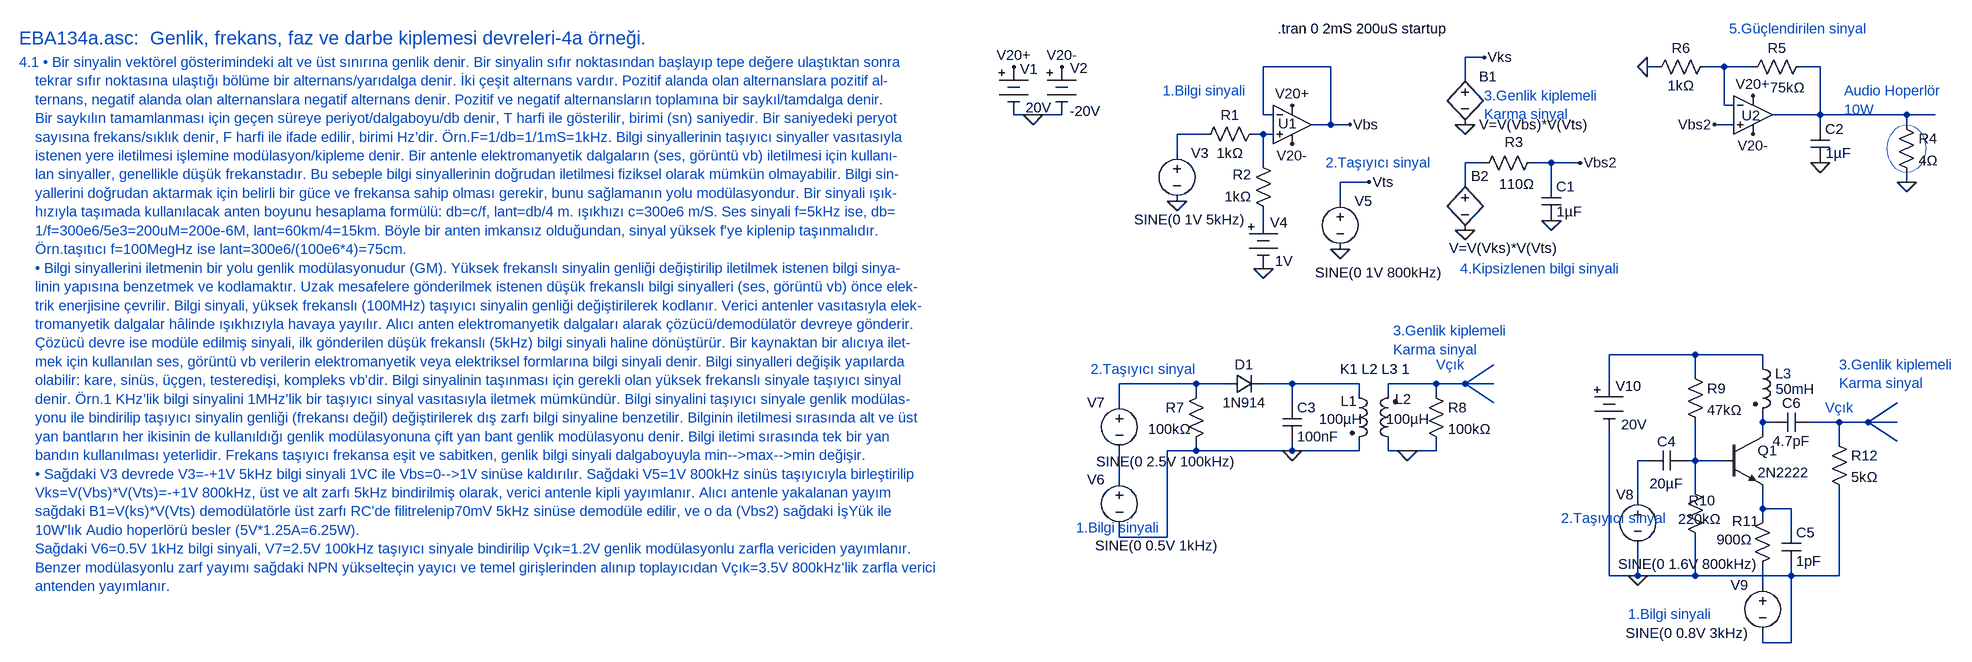
[diagram p0: schematic EBA134a.asc]
EBA134a.asc, the LTspice schematic file:
Version 4
SHEET 1 5332 4332
WIRE 2416 80 2384 80
WIRE 2160 96 2048 96
WIRE 2704 96 2688 96
WIRE 2816 96 2784 96
WIRE 2864 96 2816 96
WIRE 2976 96 2944 96
WIRE 2384 112 2384 80
WIRE 2816 160 2816 96
WIRE 2832 160 2816 160
WIRE 1664 176 1632 176
WIRE 1712 176 1664 176
WIRE 2048 176 2048 96
WIRE 2064 176 2048 176
WIRE 2976 176 2976 96
WIRE 2976 176 2896 176
WIRE 3120 176 2976 176
WIRE 3168 176 3120 176
WIRE 2160 192 2160 96
WIRE 2160 192 2128 192
WIRE 2192 192 2160 192
WIRE 2832 192 2800 192
WIRE 2976 192 2976 176
WIRE 3120 192 3120 176
WIRE 1952 208 1904 208
WIRE 2048 208 2032 208
WIRE 2064 208 2048 208
WIRE 1904 240 1904 208
WIRE 2048 256 2048 208
WIRE 2416 256 2384 256
WIRE 2528 256 2496 256
WIRE 2576 256 2528 256
WIRE 2224 288 2176 288
WIRE 2384 288 2384 256
WIRE 2528 288 2528 256
WIRE 3120 288 3120 272
WIRE 2176 320 2176 288
WIRE 2048 352 2048 336
WIRE 2768 576 2624 576
WIRE 2880 576 2768 576
WIRE 2880 592 2880 576
WIRE 2768 608 2768 576
WIRE 1936 624 1808 624
WIRE 1984 624 1936 624
WIRE 2096 624 2048 624
WIRE 2208 624 2096 624
WIRE 2336 624 2256 624
WIRE 2384 624 2432 592
WIRE 2384 624 2336 624
WIRE 2432 624 2384 624
WIRE 2624 624 2624 576
WIRE 1936 640 1936 624
WIRE 2208 640 2208 624
WIRE 2256 640 2256 624
WIRE 2336 640 2336 624
WIRE 1808 656 1808 624
WIRE 2096 656 2096 624
WIRE 2432 656 2384 624
WIRE 2880 688 2880 672
WIRE 2896 688 2880 688
WIRE 3008 688 2960 688
WIRE 3056 688 3104 656
WIRE 3056 688 3008 688
WIRE 3104 688 3056 688
WIRE 2880 704 2880 688
WIRE 3008 720 3008 688
WIRE 3104 720 3056 688
WIRE 1936 736 1936 720
WIRE 1936 736 1888 736
WIRE 2096 736 2096 720
WIRE 2096 736 1936 736
WIRE 2208 736 2208 720
WIRE 2208 736 2096 736
WIRE 2256 736 2256 720
WIRE 2288 736 2256 736
WIRE 2336 736 2336 720
WIRE 2336 736 2288 736
WIRE 2688 752 2672 752
WIRE 2768 752 2768 688
WIRE 2768 752 2752 752
WIRE 2816 752 2768 752
WIRE 1808 784 1808 736
WIRE 2768 800 2768 752
WIRE 2672 816 2672 752
WIRE 2880 832 2880 800
WIRE 2928 832 2880 832
WIRE 2880 848 2880 832
WIRE 2928 864 2928 832
WIRE 1808 880 1808 864
WIRE 1888 880 1888 736
WIRE 1888 880 1808 880
WIRE 2624 944 2624 704
WIRE 2672 944 2672 896
WIRE 2672 944 2624 944
WIRE 2768 944 2768 880
WIRE 2768 944 2672 944
WIRE 2928 944 2928 928
WIRE 2928 944 2768 944
WIRE 3008 944 3008 800
WIRE 3008 944 2928 944
WIRE 2880 960 2880 928
WIRE 2880 1056 2880 1040
WIRE 2928 1056 2928 944
WIRE 2928 1056 2880 1056
FLAG 1664 176 0
FLAG 1632 96 V20+
FLAG 1712 96 V20-
FLAG 2096 160 V20+
FLAG 2096 224 V20-
FLAG 1904 320 0
FLAG 2048 432 0
FLAG 2176 400 0
FLAG 2384 192 0
FLAG 2192 192 Vbs
FLAG 2224 288 Vts
FLAG 2416 80 Vks
FLAG 2384 368 0
FLAG 2528 352 0
FLAG 2576 256 Vbs2
FLAG 2976 256 0
FLAG 3120 288 0
FLAG 2864 144 V20+
FLAG 2864 208 V20-
FLAG 2688 96 0
FLAG 2800 192 Vbs2
FLAG 2096 736 0
FLAG 2288 736 0
FLAG 2672 944 0
SYMBOL Misc\\battery 1632 80 R0
WINDOW 0 11 20 Left 2
WINDOW 3 20 84 Left 2
SYMATTR InstName V1
SYMATTR Value 20V
SYMBOL Misc\\battery 1712 80 R0
WINDOW 0 14 18 Left 2
WINDOW 3 13 90 Left 2
SYMATTR InstName V2
SYMATTR Value -20V
SYMBOL Opamps\\UniversalOpamp2 2096 192 R0
WINDOW 0 -23 -1 Left 2
SYMATTR InstName U1
SYMBOL res 2048 192 R90
WINDOW 0 0 56 VBottom 2
WINDOW 3 32 56 VTop 2
SYMATTR InstName R1
SYMATTR Value 1kΩ
SYMBOL res 2064 352 R180
WINDOW 0 36 76 Left 2
WINDOW 3 36 40 Left 2
SYMATTR InstName R2
SYMATTR Value 1kΩ
SYMBOL voltage 1904 224 R0
WINDOW 3 -71 127 Left 2
WINDOW 123 0 0 Left 0
WINDOW 39 0 0 Left 0
SYMATTR Value SINE(0 1V 5kHz)
SYMATTR InstName V3
SYMBOL voltage 2176 304 R0
WINDOW 3 -42 135 Left 2
WINDOW 123 0 0 Left 0
WINDOW 39 0 0 Left 0
SYMATTR Value SINE(0 1V 800kHz)
SYMATTR InstName V5
SYMBOL bv 2384 96 R0
SYMATTR InstName B1
SYMATTR Value V=V(Vbs)*V(Vts)
SYMBOL bv 2384 272 R0
WINDOW 0 10 6 Left 2
WINDOW 3 -26 126 Left 2
SYMATTR InstName B2
SYMATTR Value V=V(Vks)*V(Vts)
SYMBOL res 2512 240 R90
WINDOW 0 -3 46 VBottom 2
WINDOW 3 36 41 VTop 2
SYMATTR InstName R3
SYMATTR Value 110Ω
SYMBOL cap 2512 288 R0
WINDOW 3 25 49 Left 2
SYMATTR Value 1µF
SYMATTR InstName C1
SYMBOL cap 2960 192 R0
WINDOW 3 25 48 Left 2
SYMATTR Value 1µF
SYMATTR InstName C2
SYMBOL res 3104 176 R0
SYMATTR InstName R4
SYMATTR Value 4Ω
SYMBOL res 2960 80 R90
WINDOW 0 0 56 VBottom 2
WINDOW 3 35 38 VTop 2
SYMATTR InstName R5
SYMATTR Value 75kΩ
SYMBOL res 2800 80 R90
WINDOW 0 0 56 VBottom 2
WINDOW 3 32 56 VTop 2
SYMATTR InstName R6
SYMATTR Value 1kΩ
SYMBOL OpAmps\\UniversalOpAmp 2864 176 R0
WINDOW 0 -19 1 Left 2
SYMATTR InstName U2
SYMBOL diode 1984 608 M90
WINDOW 0 0 32 VBottom 2
WINDOW 3 32 32 VTop 2
SYMATTR InstName D1
SYMATTR Value 1N914
SYMBOL res 1952 624 M0
WINDOW 3 25 76 Left 2
SYMATTR Value 100kΩ
SYMATTR InstName R7
SYMBOL cap 2080 720 M180
WINDOW 0 24 56 Left 2
WINDOW 3 24 8 Left 2
SYMATTR InstName C3
SYMATTR Value 100nF
SYMBOL ind2 2192 624 R0
WINDOW 0 -15 29 Left 2
WINDOW 3 -51 59 Left 2
SYMATTR InstName L1
SYMATTR Value 100µH
SYMATTR Type ind
SYMBOL ind2 2272 736 R180
WINDOW 0 -23 86 Left 2
WINDOW 3 -52 53 Left 2
SYMATTR InstName L2
SYMATTR Value 100µH
SYMATTR Type ind
SYMBOL res 2320 624 R0
SYMATTR InstName R8
SYMATTR Value 100kΩ
SYMBOL voltage 1808 768 M0
WINDOW 3 -163 126 Left 2
WINDOW 123 0 0 Left 0
WINDOW 39 0 0 Left 0
SYMATTR Value SINE(0 0.5V 1kHz)
SYMATTR InstName V6
SYMBOL voltage 1808 640 M0
WINDOW 3 -192 114 Left 2
WINDOW 123 0 0 Left 0
WINDOW 39 0 0 Left 0
SYMATTR Value SINE(0 2.5V 100kHz)
SYMATTR InstName V7
SYMBOL npn 2816 704 R0
SYMATTR InstName Q1
SYMATTR Value 2N2222
SYMBOL res 2752 592 R0
SYMATTR InstName R9
SYMATTR Value 47kΩ
SYMBOL res 2752 784 R0
WINDOW 0 5 35 Left 2
WINDOW 3 -13 66 Left 2
SYMATTR InstName R10
SYMATTR Value 220kΩ
SYMBOL cap 2752 736 R90
WINDOW 0 0 32 VBottom 2
WINDOW 3 39 32 VTop 2
SYMATTR InstName C4
SYMATTR Value 20µF
SYMBOL res 2896 832 M0
WINDOW 0 22 21 Left 2
WINDOW 3 33 52 Left 2
SYMATTR InstName R11
SYMATTR Value 900Ω
SYMBOL ind2 2864 576 R0
WINDOW 0 37 31 Left 2
WINDOW 3 38 57 Left 2
SYMATTR InstName L3
SYMATTR Value 50mH
SYMATTR Type ind
SYMBOL cap 2912 864 R0
SYMATTR InstName C5
SYMATTR Value 1pF
SYMBOL cap 2960 672 R90
WINDOW 0 0 32 VBottom 2
WINDOW 3 32 32 VTop 2
SYMATTR InstName C6
SYMATTR Value 4.7pF
SYMBOL res 2992 704 R0
SYMATTR InstName R12
SYMATTR Value 5kΩ
SYMBOL voltage 2672 800 M0
WINDOW 0 7 9 Left 2
WINDOW 3 -198 125 Left 2
WINDOW 123 0 0 Left 0
WINDOW 39 0 0 Left 0
SYMATTR InstName V8
SYMATTR Value SINE(0 1.6V 800kHz)
SYMBOL voltage 2880 944 M0
WINDOW 3 25 96 Left 2
WINDOW 123 0 0 Left 0
WINDOW 39 0 0 Left 0
SYMATTR Value SINE(0 0.8V 3kHz)
SYMATTR InstName V9
SYMBOL Misc\\battery 2624 608 R0
WINDOW 0 11 20 Left 2
WINDOW 3 20 84 Left 2
SYMATTR InstName V10
SYMATTR Value 20V
SYMBOL Misc\\battery 2048 336 R0
WINDOW 0 11 20 Left 2
WINDOW 3 20 84 Left 2
SYMATTR InstName V4
SYMATTR Value 1V
TEXT -224 48 Left 3 ;EBA134a.asc:  Genlik, frekans, faz ve darbe kiplemesi devreleri-4a örneği.
TEXT -224 88 Left 2 ;4.1 • Bir sinyalin vektörel gösterimindeki alt ve üst sınırına genlik denir. Bir sinyalin sıfır noktasından başlayıp tepe değere ulaştıktan sonra\n    tekrar sıfır noktasına ulaştığı bölüme bir alternans/yarıdalga denir. İki çeşit alternans vardır. Pozitif alanda olan alternanslara pozitif al-\n    ternans, negatif alanda olan alternanslara negatif alternans denir. Pozitif ve negatif alternansların toplamına bir saykıl/tamdalga denir.\n    Bir saykılın tamamlanması için geçen süreye periyot/dalgaboyu/db denir, T harfi ile gösterilir, birimi (sn) saniyedir. Bir saniyedeki peryot \n    sayısına frekans/sıklık denir, F harfi ile ifade edilir, birimi Hz’dir. Örn.F=1/db=1/1mS=1kHz. Bilgi sinyallerinin taşıyıcı sinyaller vasıtasıyla\n    istenen yere iletilmesi işlemine modülasyon/kipleme denir. Bir antenle elektromanyetik dalgaların (ses, görüntü vb) iletilmesi için kullanı-\n    lan sinyaller, genellikle düşük frekanstadır. Bu sebeple bilgi sinyallerinin doğrudan iletilmesi fiziksel olarak mümkün olmayabilir. Bilgi sin-\n    yallerini doğrudan aktarmak için belirli bir güce ve frekansa sahip olması gerekir, bunu sağlamanın yolu modülasyondur. Bir sinyali ışık-\n    hızıyla taşımada kullanılacak anten boyunu hesaplama formülü: db=c/f, lant=db/4 m. ışıkhızı c=300e6 m/S. Ses sinyali f=5kHz ise, db=\n    1/f=300e6/5e3=200uM=200e-6M, lant=60km/4=15km. Böyle bir anten imkansız olduğundan, sinyal yüksek f'ye kiplenip taşınmalıdır. \n    Örn.taşıtıcı f=100MegHz ise lant=300e6/(100e6*4)=75cm.\n    • Bilgi sinyallerini iletmenin bir yolu genlik modülasyonudur (GM). Yüksek frekanslı sinyalin genliği değiştirilip iletilmek istenen bilgi sinya-\n    linin yapısına benzetmek ve kodlamaktır. Uzak mesafelere gönderilmek istenen düşük frekanslı bilgi sinyalleri (ses, görüntü vb) önce elek-\n    trik enerjisine çevrilir. Bilgi sinyali, yüksek frekanslı (100MHz) taşıyıcı sinyalin genliği değiştirilerek kodlanır. Verici antenler vasıtasıyla elek-\n    tromanyetik dalgalar hâlinde ışıkhızıyla havaya yayılır. Alıcı anten elektromanyetik dalgaları alarak çözücü/demodülatör devreye gönderir. \n    Çözücü devre ise modüle edilmiş sinyali, ilk gönderilen düşük frekanslı (5kHz) bilgi sinyali haline dönüştürür. Bir kaynaktan bir alıcıya ilet-\n    mek için kullanılan ses, görüntü vb verilerin elektromanyetik veya elektriksel formlarına bilgi sinyali denir. Bilgi sinyalleri değişik yapılarda\n    olabilir: kare, sinüs, üçgen, testeredişi, kompleks vb'dir. Bilgi sinyalinin taşınması için gerekli olan yüksek frekanslı sinyale taşıyıcı sinyal \n    denir. Örn.1 KHz’lik bilgi sinyalini 1MHz'lik bir taşıyıcı sinyal vasıtasıyla iletmek mümkündür. Bilgi sinyalini taşıyıcı sinyale genlik modülas-\n    yonu ile bindirilip taşıyıcı sinyalin genliği (frekansı değil) değiştirilerek dış zarfı bilgi sinyaline benzetilir. Bilginin iletilmesi sırasında alt ve üst \n    yan bantların her ikisinin de kullanıldığı genlik modülasyonuna çift yan bant genlik modülasyonu denir. Bilgi iletimi sırasında tek bir yan \n    bandın kullanılması yeterlidir. Frekans taşıyıcı frekansa eşit ve sabitken, genlik bilgi sinyali dalgaboyuyla min-->max-->min değişir.\n    • Sağdaki V3 devrede V3=-+1V 5kHz bilgi sinyali 1VC ile Vbs=0-->1V sinüse kaldırılır. Sağdaki V5=1V 800kHz sinüs taşıyıcıyla birleştirilip\n    Vks=V(Vbs)*V(Vts)=-+1V 800kHz, üst ve alt zarfı 5kHz bindirilmiş olarak, verici antenle kipli yayımlanır. Alıcı antenle yakalanan yayım \n    sağdaki B1=V(ks)*V(Vts) demodülatörle üst zarfı RC'de filitrelenip70mV 5kHz sinüse demodüle edilir, ve o da (Vbs2) sağdaki İşYük ile\n    10W'lık Audio hoperlörü besler (5V*1.25A=6.25W).\n    Sağdaki V6=0.5V 1kHz bilgi sinyali, V7=2.5V 100kHz taşıyıcı sinyale bindirilip Vçık=1.2V genlik modülasyonlu zarfla vericiden yayımlanır.\n    Benzer modülasyonlu zarf yayımı sağdaki NPN yükselteçin yayıcı ve temel girişlerinden alınıp toplayıcıdan Vçık=3.5V 800kHz'lik zarfla verici\n    antenden yayımlanır.
TEXT 2072 32 Left 2 !.tran 0 2mS 200uS startup
TEXT 3016 136 Left 2 ;Audio Hoperlör\n10W
TEXT 2176 600 Left 2 !K1 L2 L3 1
TEXT 2336 592 Left 2 ;Vçık
TEXT 2984 664 Left 2 ;Vçık
TEXT 1880 136 Left 2 ;1.Bilgi sinyali
TEXT 2152 256 Left 2 ;2.Taşıyıcı sinyal
TEXT 2416 144 Left 2 ;3.Genlik kiplemeli\nKarma sinyal
TEXT 2376 432 Left 2 ;4.Kipsizlenen bilgi sinyali
TEXT 2824 32 Left 2 ;5.Güçlendirilen sinyal
TEXT 1736 864 Left 2 ;1.Bilgi sinyali
TEXT 1760 600 Left 2 ;2.Taşıyıcı sinyal
TEXT 2264 536 Left 2 ;3.Genlik kiplemeli\nKarma sinyal
TEXT 2656 1008 Left 2 ;1.Bilgi sinyali
TEXT 2544 848 Left 2 ;2.Taşıyıcı sinyal
TEXT 3008 592 Left 2 ;3.Genlik kiplemeli\nKarma sinyal
CIRCLE Normal 3152 272 3088 192 2

The netlist it stands for:
* EBA134a.asc
V1 V20+ 0 20V
V2 V20- 0 -20V
XU1 N004 Vbs V20+ V20- Vbs level.2 Avol=1Meg GBW=10Meg Slew=10Meg ilimit=25m rail=0 Vos=0 phimargin=45 en=0 enk=0 in=0 ink=0 Rin=500Meg  ; pins IN+ IN- V+ V- OUT
R1 N004 N003 1kΩ
R2 N006 N004 1kΩ
V3 N003 0 SINE(0 1V 5kHz)
V5 Vts 0 SINE(0 1V 800kHz)
B1 Vks 0 V=V(Vbs)*V(Vts)
B2 N005 0 V=V(Vks)*V(Vts)
R3 Vbs2 N005 110Ω
C1 Vbs2 0 1µF
C2 N002 0 1µF
R4 N002 0 4Ω
R5 N002 N001 75kΩ
R6 N001 0 1kΩ
XU2 Vbs2 N001 V20+ V20- N002 level1 Avol=1Meg GBW=10Meg Vos=0 En=0 Enk=0 In=0 Ink=0 Rin=500Meg  ; pins In+ In- V+ V- OUT
D1 N008 N009 1N914
R7 N008 0 100kΩ
C3 0 N009 100nF
L1 N009 0 100µH
L2 0 N010 100µH
R8 N010 0 100kΩ
V6 N015 0 SINE(0 0.5V 1kHz)
V7 N008 N015 SINE(0 2.5V 100kHz)
Q1 N011 N014 N016 0 2N2222
R9 N007 N014 47kΩ
R10 N014 0 220kΩ
C4 N014 N013 20µF
R11 N016 N017 900Ω
L3 N007 N011 50mH
C5 N016 0 1pF
C6 N012 N011 4.7pF
R12 N012 0 5kΩ
V8 N013 0 SINE(0 1.6V 800kHz)
V9 N017 0 SINE(0 0.8V 3kHz)
V10 N007 0 20V
V4 N006 0 1V
.model D D
.lib standard.dio
.model NPN NPN
.model PNP PNP
.lib standard.bjt
* EBA134a.asc:  Genlik, frekans, faz ve darbe kiplemesi devreleri-4a örneği.
* 4.1 • Bir sinyalin vektörel gösterimindeki alt ve üst sınırına genlik denir. Bir sinyalin sıfır noktasından başlayıp tepe değere ulaştıktan sonra
*     tekrar sıfır noktasına ulaştığı bölüme bir alternans/yarıdalga denir. İki çeşit alternans vardır. Pozitif alanda olan alternanslara pozitif al-
*     ternans, negatif alanda olan alternanslara negatif alternans denir. Pozitif ve negatif alternansların toplamına bir saykıl/tamdalga denir.
*     Bir saykılın tamamlanması için geçen süreye periyot/dalgaboyu/db denir, T harfi ile gösterilir, birimi (sn) saniyedir. Bir saniyedeki peryot
*     sayısına frekans/sıklık denir, F harfi ile ifade edilir, birimi Hz’dir. Örn.F=1/db=1/1mS=1kHz. Bilgi sinyallerinin taşıyıcı sinyaller vasıtasıyla
*     istenen yere iletilmesi işlemine modülasyon/kipleme denir. Bir antenle elektromanyetik dalgaların (ses, görüntü vb) iletilmesi için kullanı-
*     lan sinyaller, genellikle düşük frekanstadır. Bu sebeple bilgi sinyallerinin doğrudan iletilmesi fiziksel olarak mümkün olmayabilir. Bilgi sin-
*     yallerini doğrudan aktarmak için belirli bir güce ve frekansa sahip olması gerekir, bunu sağlamanın yolu modülasyondur. Bir sinyali ışık-
*     hızıyla taşımada kullanılacak anten boyunu hesaplama formülü: db=c/f, lant=db/4 m. ışıkhızı c=300e6 m/S. Ses sinyali f=5kHz ise, db=
*     1/f=300e6/5e3=200uM=200e-6M, lant=60km/4=15km. Böyle bir anten imkansız olduğundan, sinyal yüksek f'ye kiplenip taşınmalıdır.
*     Örn.taşıtıcı f=100MegHz ise lant=300e6/(100e6*4)=75cm.
*     • Bilgi sinyallerini iletmenin bir yolu genlik modülasyonudur (GM). Yüksek frekanslı sinyalin genliği değiştirilip iletilmek istenen bilgi sinya-
*     linin yapısına benzetmek ve kodlamaktır. Uzak mesafelere gönderilmek istenen düşük frekanslı bilgi sinyalleri (ses, görüntü vb) önce elek-
*     trik enerjisine çevrilir. Bilgi sinyali, yüksek frekanslı (100MHz) taşıyıcı sinyalin genliği değiştirilerek kodlanır. Verici antenler vasıtasıyla elek-
*     tromanyetik dalgalar hâlinde ışıkhızıyla havaya yayılır. Alıcı anten elektromanyetik dalgaları alarak çözücü/demodülatör devreye gönderir.
*     Çözücü devre ise modüle edilmiş sinyali, ilk gönderilen düşük frekanslı (5kHz) bilgi sinyali haline dönüştürür. Bir kaynaktan bir alıcıya ilet-
*     mek için kullanılan ses, görüntü vb verilerin elektromanyetik veya elektriksel formlarına bilgi sinyali denir. Bilgi sinyalleri değişik yapılarda
*     olabilir: kare, sinüs, üçgen, testeredişi, kompleks vb'dir. Bilgi sinyalinin taşınması için gerekli olan yüksek frekanslı sinyale taşıyıcı sinyal
*     denir. Örn.1 KHz’lik bilgi sinyalini 1MHz'lik bir taşıyıcı sinyal vasıtasıyla iletmek mümkündür. Bilgi sinyalini taşıyıcı sinyale genlik modülas-
*     yonu ile bindirilip taşıyıcı sinyalin genliği (frekansı değil) değiştirilerek dış zarfı bilgi sinyaline benzetilir. Bilginin iletilmesi sırasında alt ve üst
*     yan bantların her ikisinin de kullanıldığı genlik modülasyonuna çift yan bant genlik modülasyonu denir. Bilgi iletimi sırasında tek bir yan
*     bandın kullanılması yeterlidir. Frekans taşıyıcı frekansa eşit ve sabitken, genlik bilgi sinyali dalgaboyuyla min-->max-->min değişir.
*     • Sağdaki V3 devrede V3=-+1V 5kHz bilgi sinyali 1VC ile Vbs=0-->1V sinüse kaldırılır. Sağdaki V5=1V 800kHz sinüs taşıyıcıyla birleştirilip
*     Vks=V(Vbs)*V(Vts)=-+1V 800kHz, üst ve alt zarfı 5kHz bindirilmiş olarak, verici antenle kipli yayımlanır. Alıcı antenle yakalanan yayım
*     sağdaki B1=V(ks)*V(Vts) demodülatörle üst zarfı RC'de filitrelenip70mV 5kHz sinüse demodüle edilir, ve o da (Vbs2) sağdaki İşYük ile
*     10W'lık Audio hoperlörü besler (5V*1.25A=6.25W).
*     Sağdaki V6=0.5V 1kHz bilgi sinyali, V7=2.5V 100kHz taşıyıcı sinyale bindirilip Vçık=1.2V genlik modülasyonlu zarfla vericiden yayımlanır.
*     Benzer modülasyonlu zarf yayımı sağdaki NPN yükselteçin yayıcı ve temel girişlerinden alınıp toplayıcıdan Vçık=3.5V 800kHz'lik zarfla verici
*     antenden yayımlanır.
.tran 0 2mS 200uS startup
* Audio Hoperlör
* 10W
K1 L2 L3 1
* Vçık
* Vçık
* 1.Bilgi sinyali
* 2.Taşıyıcı sinyal
* 3.Genlik kiplemeli
* Karma sinyal
* 4.Kipsizlenen bilgi sinyali
* 5.Güçlendirilen sinyal
* 1.Bilgi sinyali
* 2.Taşıyıcı sinyal
* 3.Genlik kiplemeli
* Karma sinyal
* 1.Bilgi sinyali
* 2.Taşıyıcı sinyal
* 3.Genlik kiplemeli
* Karma sinyal
.lib UniversalOpamps2.sub
.lib UniversalOpAmp1.lib
.backanno
.end